# EAGLE design PB32_3.x (EAGLE 9.6.2)
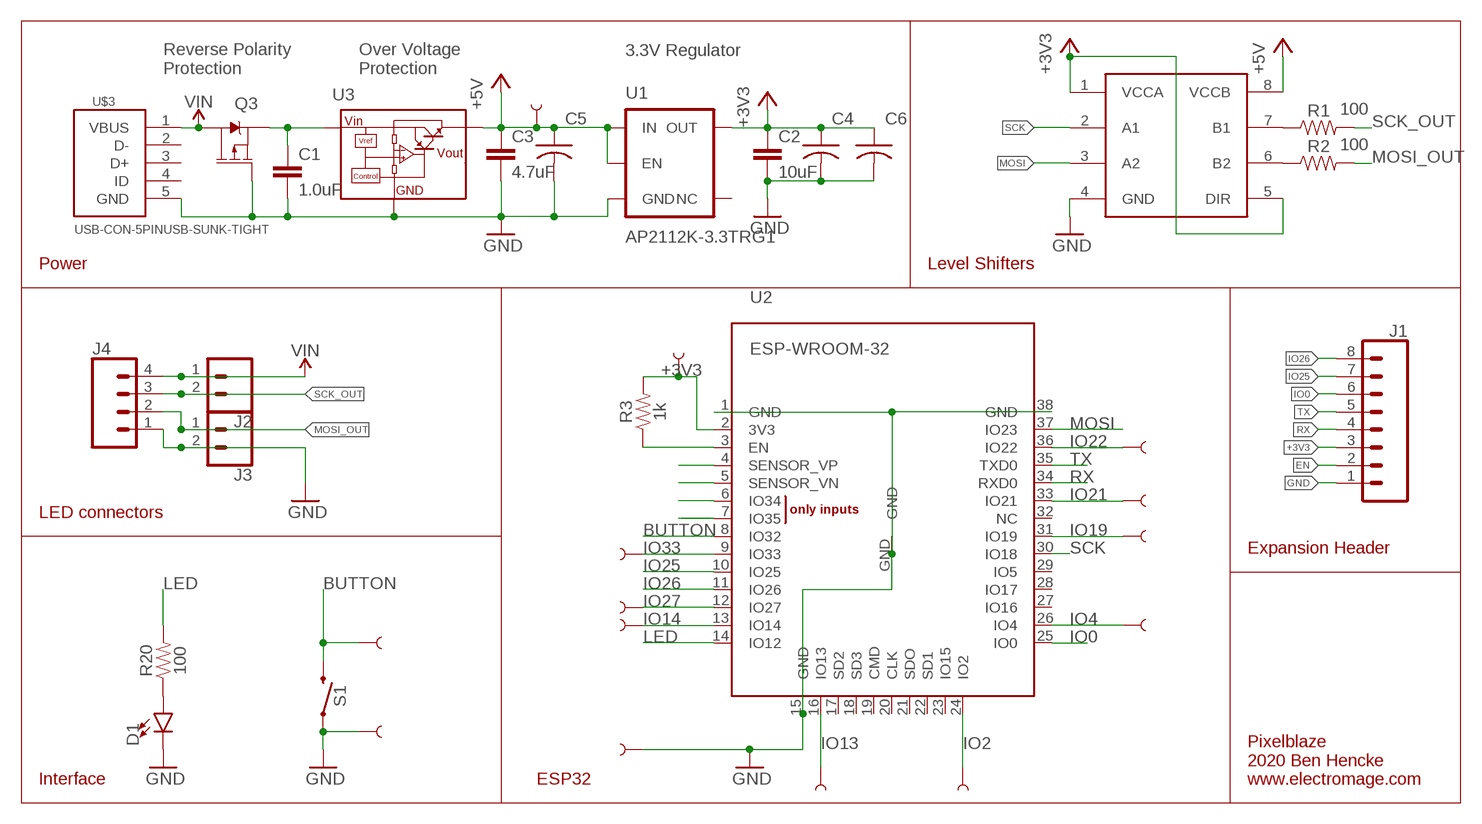
[diagram p0: schematic, sheet 1]

## Parts
C1  1.0uF  1.0UF-25V-+80/-20(0805)"  [0805-CAP]
C2  10uF  10UF-0805-10V-10%  [0805]
C3  4.7uF  4.7UF0603  [0603]
C4  0.1uF  C-USC0402K  [C0402K]
C5  0.1uF  C-USC0402K  [C0402K]
C6  0.1uF  C-USC0402K  [C0402K]
D1  LED0603  [LED-0603]
GP1  SMTPAD  [PAD]
GP3  SMTPAD  [PAD]
GP6  SMTPAD  [PAD]
GP8  SMTPAD  [PAD]
GP9  SMTPAD  [PAD]
IO2  SMTPAD  [PAD]
IO4  SMTPAD  [PAD]
IO13  SMTPAD  [PAD]
IO14  SMTPAD  [PAD]
IO19  SMTPAD  [PAD]
IO21  SMTPAD  [PAD]
IO22  SMTPAD  [PAD]
IO27  SMTPAD  [PAD]
IO33  SMTPAD  [PAD]
J1  CONN_08LOCK  [1X08_LOCK]
J2  CONN_025MM  [SCREWTERMINAL-5MM-2]
J3  CONN_025MM  [SCREWTERMINAL-5MM-2]
J4  CONN_041X04_NO_SILK  [1X04_NO_SILK]
Q3  2.5A/30V/105mΩ  MOSFET_PCH-DMG2307L  [SOT23-3]
R1  100  100OHM-0603-1/10W-1%  [0603]
R2  100  100OHM-0603-1/10W-1%  [0603]
R3  1k  1KOHM-0603-1/10W-1%  [0603]
R20  100  100OHM-0603-1/10W-1%  [0603]
S1  MOMENTARY-SWITCH-SPST-SMD-5.2MM  [TACTILE_SWITCH_SMD_5.2MM]
U1  AP2112K-3.3TRG1  V_REG_AP2112K-3.3V  [SOT23-5]
U2  ESP-WROOM-32  [ESP-WROOM-32]
U3  NX1117C15Z  [SOT223]
U$1  SN74LVC2T45DCUR  [SOP50P310X90-8N]
U$3  USB-CON-5PINUSB-SUNK-TIGHT  [USB-SUNK-TIGHT]

## Nets
+3V3: C2.1 C4.1 C6.1 GP1.P$1 J1.3 R3.2 U1.5(OUT) U2.2(3V3) U$1.1(VCCA) U$1.5(DIR)
+5V: C3.1 C5.1 GP6.P$1 U1.1(IN) U1.3(EN) U3.2(VOUT) U3.4(VOUT) U$1.8(VCCB)
BUTTON: GP8.P$1 S1.3 U2.8(IO32)
EN: J1.2 R3.1 U2.3(EN)
GND: C1.2 C2.2 C3.2 C4.2 C5.2 C6.2 D1.C GP3.P$1 GP9.P$1 J1.1 J3.2 J4.1 Q3.1(G) S1.1 U1.2(GND) U2.1(GND) U2.15(GND) U2.38(GND) U2.GND U3.1(GND) U$1.4(GND) U$3.5(GND)
IO0: J1.6 U2.25(IO0)
IO2: IO2.P$1 U2.24(IO2)
IO4: IO4.P$1 U2.26(IO4)
IO13: IO13.P$1 U2.16(IO13)
IO14: IO14.P$1 U2.13(IO14)
IO19: IO19.P$1 U2.31(IO19)
IO21: IO21.P$1 U2.33(IO21)
IO22: IO22.P$1 U2.36(IO22)
IO25: J1.7 U2.10(IO25)
IO26: J1.8 U2.11(IO26)
IO27: IO27.P$1 U2.12(IO27)
IO33: IO33.P$1 U2.9(IO33)
LED: R20.2 U2.14(IO12)
MOSI: U2.37(IO23) U$1.3(A2)
MOSI_OUT: J3.1 J4.2 R2.2
N$1: U2.6(IO34)
N$2: C1.1 Q3.2(S) U3.3(VIN)
N$3: U2.7(IO35)
N$4: R1.1 U$1.7(B1)
N$5: R2.1 U$1.6(B2)
N$6: U2.5(SENSOR_VN)
N$7: U2.4(SENSOR_VP)
N$29: D1.A R20.1
RX: J1.4 U2.34(RXD0)
SCK: U2.30(IO18) U$1.2(A1)
SCK_OUT: J2.2 J4.3 R1.2
TX: J1.5 U2.35(TXD0)
VIN: J2.1 J4.4 Q3.3(D) U$3.1(VBUS)
Unconnected: U1.4(NC) U2.17(SD2) U2.18(SD3) U2.19(CMD) U2.20(CLK) U2.21(SDO) U2.22(SD1) U2.23(IO15) U2.27(IO16) U2.28(IO17) U2.29(IO5) U2.32(NC) U$3.2(D-) U$3.3(D+) U$3.4(ID)

## Notes on the sheet
- 3.3V Regulator
- Reverse Polarity
  Protection
- Over Voltage
  Protection
- Power | Level Shifters
- LED connectors
- Expansion Header
- Interface | ESP32
- Pixelblaze
  2020 Ben Hencke
  www.electromage.com

## Library data of the parts
C1 = SparkFun-Capacitors:1.0UF-25V-+80/-20(0805): CAP-11625; PROD_ID: CAP-11625
C2 = SparkFun-Capacitors:10UF: 10.0µF ceramic capacitors A capacitor is a passive two-terminal electrical component used to store electrical energy temporarily in an electric field.; PROD_ID: CAP-11330
C3 = SparkFun-Capacitors:4.7UF: 4.7µF ceramic capacitors A capacitor is a passive two-terminal electrical component used to store electrical energy temporarily in an electric field.; PROD_ID: CAP-08280
C4-C6 = adafruit:C-US: CAPACITOR, American symbol
D1 = SparkFun-LED:LED: LED (Generic) Standard schematic elements and footprints for 5mm, 3mm, 1206, and 0603 sized LEDs. Generic LEDs with no color specified.
GP1 GP3 GP6 GP8 GP9 IO2 IO4 IO13 IO14 IO19 IO21 IO22 IO27 IO33 = bens:SMTPAD
J1 = SparkFun-Connectors:CONN_08: Multi connection point. Often used as Generic Header-pin footprint for 0.1 inch spaced/style header connections On any of the 0.1 inch spaced packages, you can populate with these: Break Away Headers - Straight <https://www.sparkfun.com/products/116> (PRT-00116) Break Away Male Headers - Right Angle <https://www.sparkfun.com/products/553> (PRT-00553) Female Headers <https://www.sparkfun.com/products/115> (PRT-00115) Break Away Headers - Machine Pin <https://www.sparkfun.com/products/117> (PRT-00117) Break Away Female Headers - Swiss Machine Pin <https://www.sparkfun.com/products/743> (PRT-00743) Arduino Stackable Header - 8 Pin <https://www.sparkfun.com/products/9279> (PRT-09279) For SCREWTERMINALS and SPRING TERMINALS visit here: Screw Terimnals on SparkFun.com <https://www.sparkfun.com/search/results?term=Screw+Terminals> (5mm/3.5mm/2.54mm spacing) This device is also useful as a general connection point to wire up your design to another part of your project. Our various solder wires solder well into these plated through hole pads. Hook-Up Wire - Assortment (Stranded, 22 AWG) <https://www.sparkfun.com/products/11375> (PRT-11375) Hook-Up Wire - Assortment (Solid Core, 22 AWG) <https://www.sparkfun.com/products/11367> (PRT-11367) View the entire wire category on our website here <https://www.sparkfun.com/categories/141> Special notes: Molex polarized connector foot print use with SKU : PRT-08231 with associated crimp pins and housings. 1MM SMD Version SKU: PRT-10208 NOTES ON THE VARIANTS LOCK and LOCK_LONGPADS... This footprint was designed to help hold the alignment of a through-hole component (i.e. 6-pin header) while soldering it into place. You may notice that each hole has been shifted either up or down by 0.005 of an inch from it's more standard position (which is a perfectly straight line). This slight alteration caused the pins (the squares in the middle) to touch the edges of the holes. Because they are alternating, it causes a "brace" to hold the component in place. 0.005 has proven to be the perfect amount of "off-center" position when using our standard breakaway headers. Although looks a little odd when you look at the bare footprint, once you have a header in there, the alteration is very hard to notice. Also,if you push a header all the way into place, it is covered up entirely on the bottom side.
J2 J3 = bens:CONN_02: Multi connection point. Often used as Generic Header-pin footprint for 0.1 inch spaced/style header connections On any of the 0.1 inch spaced packages, you can populate with these: Break Away Headers - Straight <https://www.sparkfun.com/products/116> (PRT-00116) Break Away Male Headers - Right Angle <https://www.sparkfun.com/products/553> (PRT-00553) Female Headers <https://www.sparkfun.com/products/115> (PRT-00115) Break Away Headers - Machine Pin <https://www.sparkfun.com/products/117> (PRT-00117) Break Away Female Headers - Swiss Machine Pin <https://www.sparkfun.com/products/743> (PRT-00743) For SCREWTERMINALS and SPRING TERMINALS visit here: Screw Terimnals on SparkFun.com <https://www.sparkfun.com/search/results?term=Screw+Terminals> (5mm/3.5mm/2.54mm spacing) This device is also useful as a general connection point to wire up your design to another part of your project. Our various solder wires solder well into these plated through hole pads. Hook-Up Wire - Assortment (Stranded, 22 AWG) <https://www.sparkfun.com/products/11375> (PRT-11375) Hook-Up Wire - Assortment (Solid Core, 22 AWG) <https://www.sparkfun.com/products/11367> (PRT-11367) View the entire wire category on our website here <https://www.sparkfun.com/categories/141> Special notes: Molex polarized connector foot print use with: PRT-08233 with associated crimp pins and housings. 2.54_SCREWTERM for use with PRT-10571. 3.5mm Screw Terminal footprints for PRT-08084 5mm Screw Terminal footprints for use with PRT-08432; SF_SKU: PRT-08432
J4 = SparkFun-Connectors:CONN_04: Multi connection point. Often used as Generic Header-pin footprint for 0.1 inch spaced/style header connections On any of the 0.1 inch spaced packages, you can populate with these: Break Away Headers - Straight <https://www.sparkfun.com/products/116> (PRT-00116) Break Away Male Headers - Right Angle <https://www.sparkfun.com/products/553> (PRT-00553) Female Headers <https://www.sparkfun.com/products/115> (PRT-00115) Break Away Headers - Machine Pin <https://www.sparkfun.com/products/117> (PRT-00117) Break Away Female Headers - Swiss Machine Pin <https://www.sparkfun.com/products/743> (PRT-00743) For SCREWTERMINALS and SPRING TERMINALS visit here: Screw Terimnals on SparkFun.com <https://www.sparkfun.com/search/results?term=Screw+Terminals> (5mm/3.5mm/2.54mm spacing) This device is also useful as a general connection point to wire up your design to another part of your project. Our various solder wires solder well into these plated through hole pads. Hook-Up Wire - Assortment (Stranded, 22 AWG) <https://www.sparkfun.com/products/11375> (PRT-11375) Hook-Up Wire - Assortment (Solid Core, 22 AWG) <https://www.sparkfun.com/products/11367> (PRT-11367) View the entire wire category on our website here <https://www.sparkfun.com/categories/141> Special notes: Molex polarized connector foot print use with SKU : PRT-08231 with associated crimp pins and housings. 1MM SMD Version SKU: PRT-10208; PROD_ID: CONN-09696
Q3 = SparkFun-DiscreteSemi:MOSFET_PCH: P-channel MOSFETs Voltage controlled devices that allow control of high current outputs. SparkFun Products: SparkFun ESP32 Thing <https://www.sparkfun.com/products/13907> SparkFun ESP8266 Thing <https://www.sparkfun.com/products/13231>; PROD_ID: TRANS-11308
R1 R2 R20 = SparkFun-Resistors:100OHM: 100Ω resistor A resistor is a passive two-terminal electrical component that implements electrical resistance as a circuit element. Resistors act to reduce current flow, and, at the same time, act to lower voltage levels within circuits. - Wikipedia; PROD_ID: RES-07863
R3 = SparkFun-Resistors:1KOHM: 1kΩ resistor A resistor is a passive two-terminal electrical component that implements electrical resistance as a circuit element. Resistors act to reduce current flow, and, at the same time, act to lower voltage levels within circuits. - Wikipedia; PROD_ID: RES-07856
S1 = SparkFun-Switches:MOMENTARY-SWITCH-SPST: Momentary Switch (Pushbutton) - SPST Normally-open (NO) SPST momentary switches (buttons, pushbuttons). Variants PTH-12MM - 12mm square, through-hole Momentary Pushbutton Switch - 12mm Square <https://www.sparkfun.com/products/9190> (COM-09190) PTH-6.0MM, PTH-6.0MM-KIT - 6.0mm square, through-hole Mini Pushbutton Switch <https://www.sparkfun.com/products/97> (COM-00097) KIT package intended for soldering kit's - only one side of pads' copper is exposed. PTH-RIGHT-ANGLE-KIT - Right-angle, through-hole Right Angle Tactile Button <https://www.sparkfun.com/products/10791> - Used on SparkFun BigTime Watch Kit <https://www.sparkfun.com/products/11734> SMD-12MM - 12mm square, surface-mount Tactile Button - SMD (12mm) <https://www.sparkfun.com/products/12993> (COM-12993) Used on SparkFun PicoBoard <https://www.sparkfun.com/products/11888> SMD-4.5MM - 4.5mm Square Trackball Switch Used on SparkFun Blackberry Trackballer Breakout <https://www.sparkfun.com/products/13169> SMD-4.6MMX2.8MM - 4.60mm x 2.80mm, surface mount Used on SparkFun SAMD21 Mini Breakout <https://www.sparkfun.com/products/13664> SMD-5.2MM, SMD-5.2-REDUNDANT - 5.2mm square, surface-mount Mini Pushbutton Switch - SMD <https://www.sparkfun.com/products/8720> (COM-08720) Used on Arduino Pro Mini <https://www.sparkfun.com/products/11114> REDUNDANT package connects both switch circuits together SMD-6.0X3.5MM - 6.0 x 3.5mm, surface mount Momentary Reset Switch SMD <https://www.sparkfun.com/products/8229> (COM-08229) SMD-6.2MM-TALL - 6.2mm square, surface mount Tactile Button - SMD (6mm) <https://www.sparkfun.com/products/12992> Used on SparkFun Digital Sandbox <https://www.sparkfun.com/products/12651> SMD-RIGHT-ANGLE - Right-angle, surface mount Used on SparkFun Block for Intel® Edison - Arduino <https://www.sparkfun.com/products/13036>; PROD_ID: SWCH-08247; SF_SKU: COM-08720
U1 = SparkFun-PowerIC:V_REG_AP2112: AP2112 - 600mA CMOS LDO Regulator w/ Enable The AP2112 is CMOS process low dropout linear regulator with enable function, the regulator delivers a guaranteed 600mA (min.) continuous load current. Features Output Voltage Accuracy: ±1.5% Output Current: 600mA (Min.) Foldback Short Current Protection: 50mA Enable Function to Turn ON/OFF VOUT Low Dropout Voltage (3.3V): 250mV (Typ.) @IOUT=600mA Excellent Load Regulation: 0.2%/A (Typ.) Excellent Line Regulation: 0.02%/V (Typ.) Low Quiescent Current: 55μA (Typ.) Low Standby Current: 0.01μA (Typ.) Low Output Noise: 50μVRMS PSRR: 100Hz -65dB, 1kHz -65dB OTSD Protection Stable with 1.0μF Flexible Cap: Ceramic, Tantalum and Aluminum Electrolytic Operation Temperature Range: -40°C to 85°C ESD: MM 400V, HBM 4000V; PROD_ID: VREG-12457; VALUE: 3.3V
U2 = esp32:ESP-WROOM-32
U3 = NXP_60_26022015:NX1117C: The NX1117C/NX1117CE are two series of low-dropout positive voltage regulators with an output current capability of 1 A. AAL Eindhoven MK; 12NC: 9352 914 35115; TOLERANCE: 1.25%; VOLTAGE: 5.0V
U$1 = SOP50P310X90-8N:SN74LVC2T45DCUR
U$3 = bens:USB-CON-5PIN: Molex Micro USB 105017-0001

## Net classes
1 power: width 0.635 mm

## Board
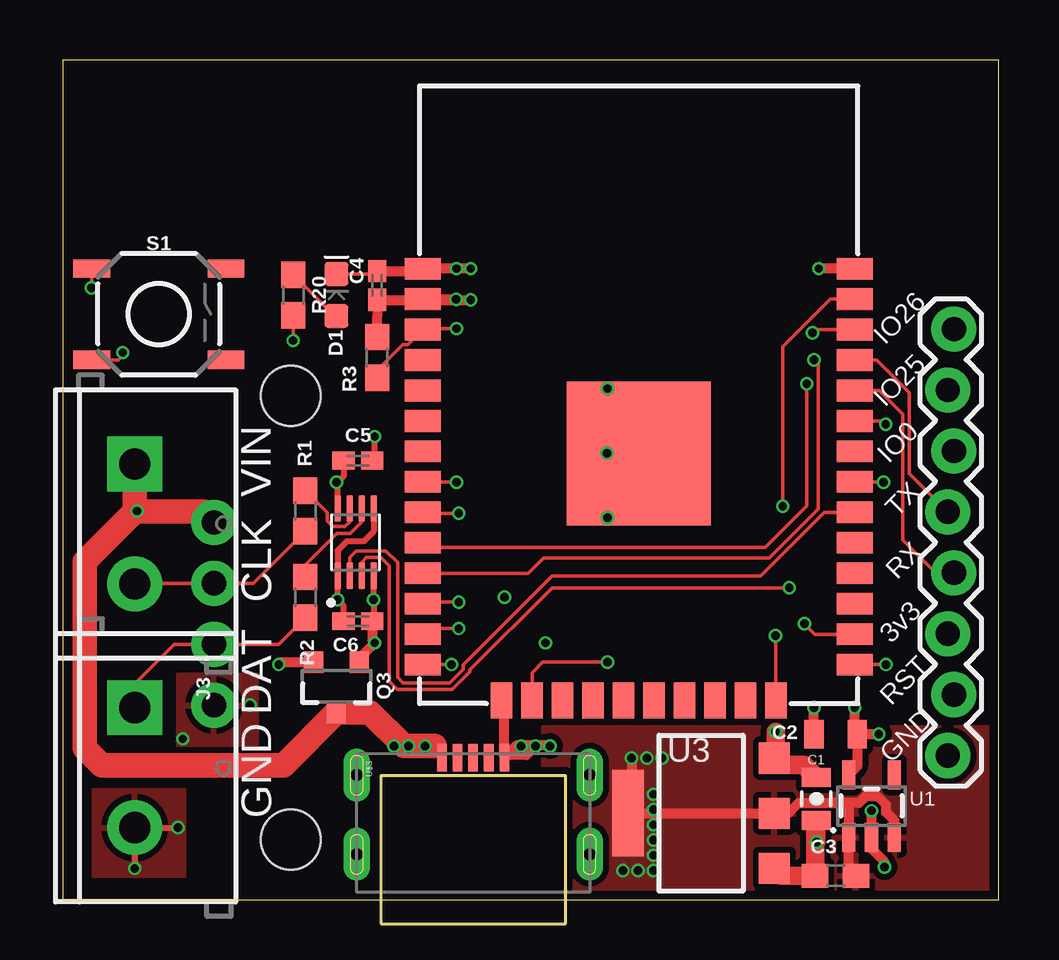
[diagram p1: board, top side]
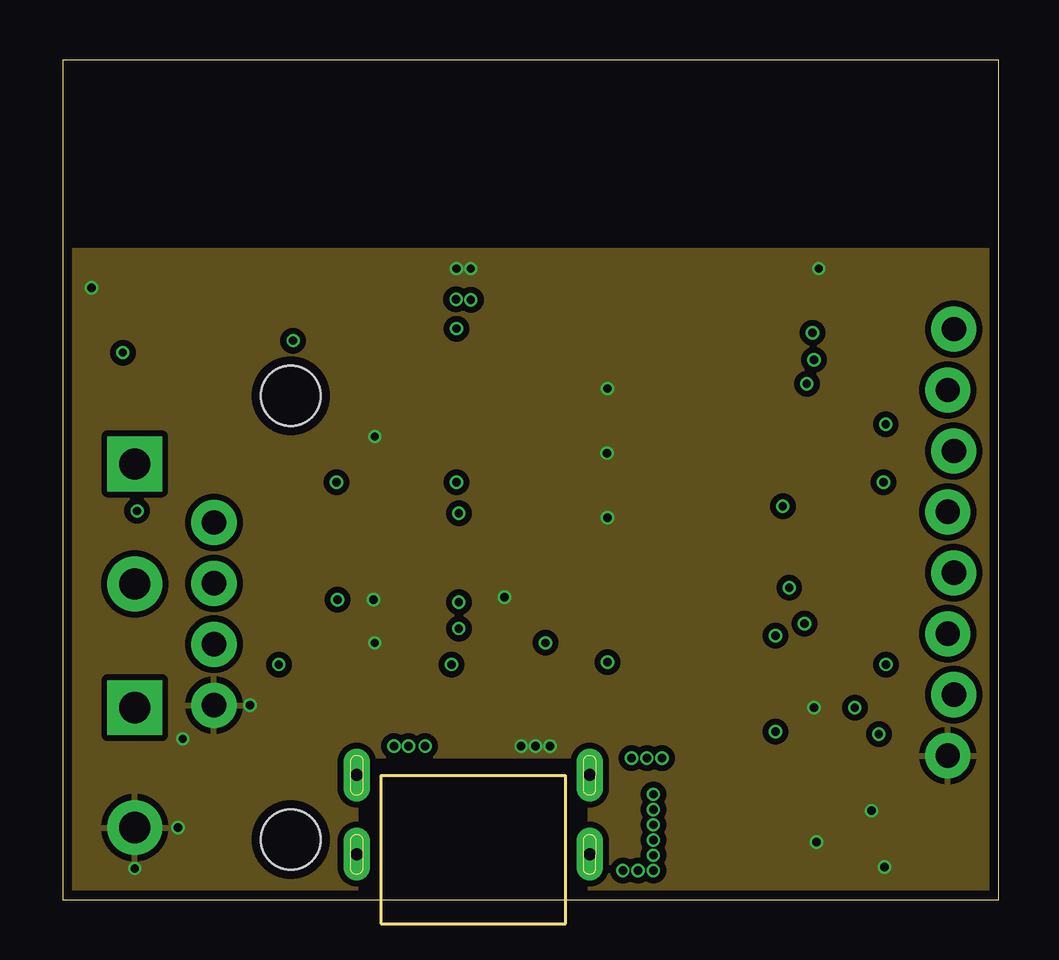
[diagram p2: board, inner layer Route2]
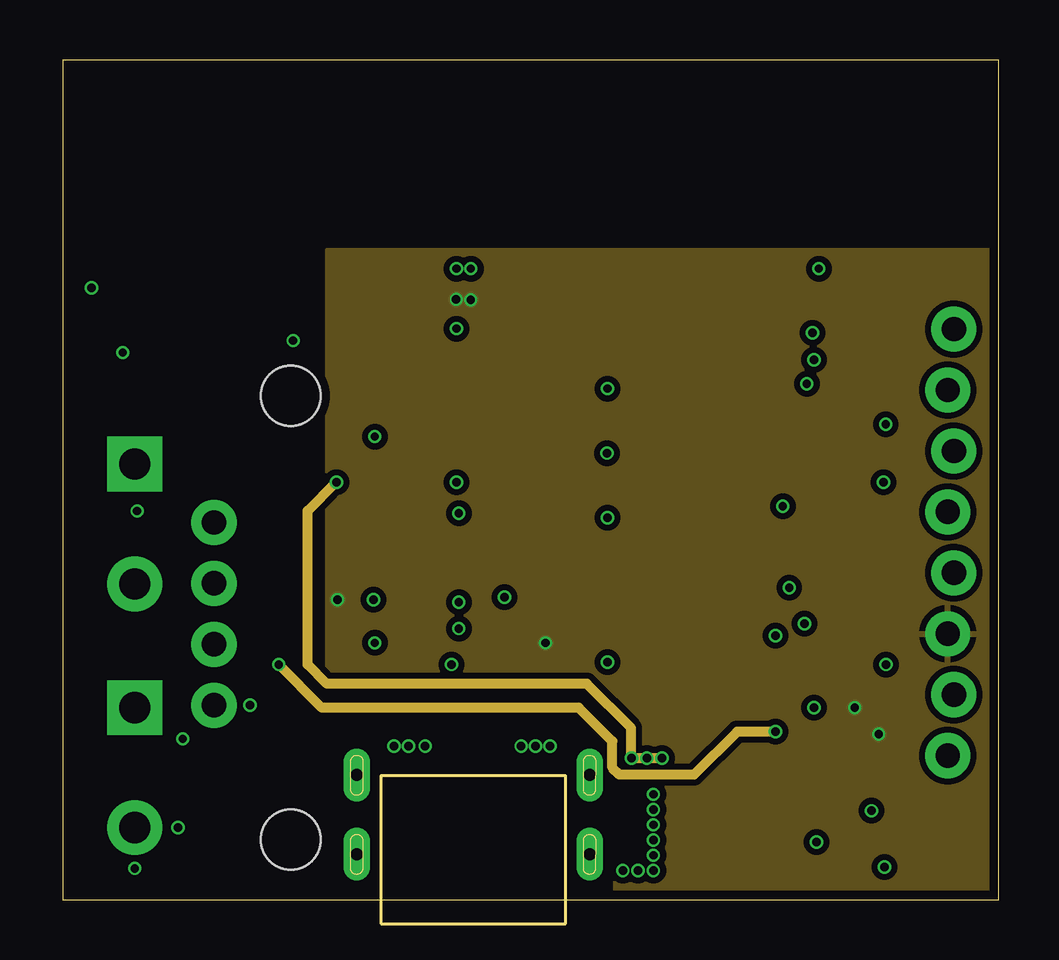
[diagram p3: board, inner layer Route15]
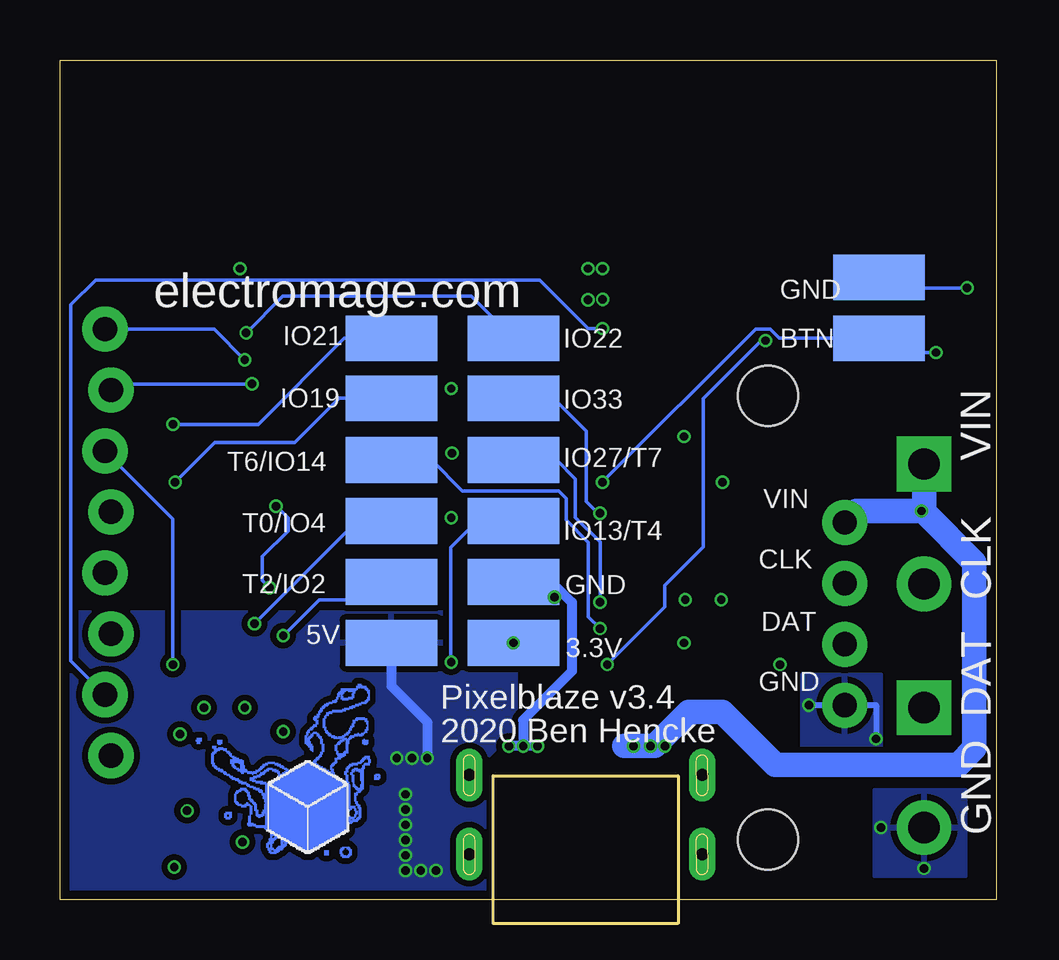
[diagram p4: board, bottom side, seen from below]

Size 39 x 35 mm. Coordinates in mm from the lower left corner, seen from the top.
Outline: 0,0 39,0 39,35 0,35 0,0
Copper layers (1*2*15*16): Top 0.035559375mm / dielectric 0.17018125mm / Route2 0.01778125mm / dielectric 47mil / Route15 0.01778125mm / dielectric 0.17018125mm / Bottom 0.035559375mm
Design rules "oshpark-4layer *": minimum track width 5mil, minimum drill 10mil, track to track 5mil, track to pad 5mil, pad to pad 5mil, via to via 5mil, smd to smd 5mil, copper to edge 15mil, drill to drill 6mil, minimum pad ring 4mil, minimum via ring 4mil, stop-mask expansion 1mil, vias tented up to drill 15mil, thermal gap 10mil
Holes 2.5 mm at 9.5,21 9.5,2.5
tRestrict: area 13.2,0.1 to 20.9,5.2

### Footprints (pad centres in the part's own frame; a part is rotated, then mirrored left to right if it is on the bottom)
0805-CAP = smd 0.8 x 1.2: 1 -0.9,0; 2 0.9,0
0805 = smd 0.8 x 1.2: 1 -0.9,0; 2 0.9,0
0603 = smd 1.1 x 1: 1 -0.85,0; 2 0.85,0
C0402K = smd 0.925 x 0.74: 1 -0.6,0; 2 0.6,0
LED-0603 = smd 1 x 1: A -0.877,0; C 0.877,0
PAD = smd 3.81 x 1.905: P$1 0,0
1X08_LOCK = drill 1.016 pad 1.88: 1 0,0.127; 2 2.54,-0.127; 3 5.08,0.127; 4 7.62,-0.127; 5 10.16,0.127; 6 12.7,-0.127; 7 15.24,0.127; 8 17.78,-0.127
SCREWTERMINAL-5MM-2 = drill 1.3 pad 2.286 square: 1 0,0 | drill 1.3 pad 2.286: 2 5,0
1X04_NO_SILK = drill 1.016 pad 1.88: 1 0,0; 2 2.54,0; 3 5.08,0; 4 7.62,0
SOT23-3 = smd 0.8 x 0.9: 1 -0.95,-1; 2 0.95,-1; 3 0,1.1
TACTILE_SWITCH_SMD_5.2MM = smd 1.524 x 0.762: 1 -2.794,1.905; 2 2.794,1.905; 3 -2.794,-1.905; 4 2.794,-1.905
SOT23-5 = smd 0.55 x 1.2: 1 -0.95,-1.3; 2 0,-1.3; 3 0.95,-1.3; 4 0.95,1.3; 5 -0.95,1.3
ESP-WROOM-32 = smd 0.9 x 1.5: 1 7.7,9; 2 6.43,9; 3 5.16,9; 4 3.89,9; 5 2.62,9; 6 1.35,9; 7 0.08,9; 8 -1.19,9; 9 -2.46,9; 10 -3.73,9; 11 -5,9; 12 -6.27,9; 13 -7.54,9; 14 -8.81,9; 25 -8.81,-9; 26 -7.54,-9; 27 -6.27,-9; 28 -5,-9; 29 -3.73,-9; 30 -2.46,-9; 31 -1.19,-9; 32 0.08,-9; 33 1.35,-9; 34 2.62,-9; 35 3.89,-9; 36 5.16,-9; 37 6.43,-9; 38 7.7,-9 | smd 1.5 x 0.9: 15 -10.3,5.715; 16 -10.3,4.445; 17 -10.3,3.175; 18 -10.3,1.905; 19 -10.3,0.635; 20 -10.3,-0.635; 21 -10.3,-1.905; 22 -10.3,-3.175; 23 -10.3,-4.445; 24 -10.3,-5.715 | smd 6 x 6: GND 0,0
SOT223 = smd 1.3 x 1.3: 1 -2.3,-3.05; 2 0,-3.05; 3 2.3,-3.05 | smd 3.6 x 1.3: 4 0,3.05
SOP50P310X90-8N = smd 1.12 x 0.27: 1 -1.405,0.75; 2 -1.405,0.25; 3 -1.405,-0.25; 4 -1.405,-0.75; 5 1.405,-0.75; 6 1.405,-0.25; 7 1.405,0.25; 8 1.405,0.75
USB-SUNK-TIGHT = smd 0.4 x 1.15: 1 -1.3,2.625; 2 -0.65,2.625; 3 0,2.625; 4 0.65,2.625; 5 1.3,2.625 | drill 0.5 pad 1.1 long: 6 -4.85,1.89; 7 -4.85,-1.41; 8 4.85,1.89; 9 4.85,-1.41 | smd 0.1 x 0.1: P$4 -4.826,-2.413; P$5 4.826,-2.413

### Placement (x,y rotation side)
C1  31.4,4.2 270 top
C2  32.2,6.9 180 top
C3  32.2,1 180 top
C4  13.1,25.6 90 top
C5  12.3,18.3 0 top
C6  12.3,11.6 0 top
D1  11.4,25.2 90 top
GP1  20.11,10.7 0 bottom
GP3  20.11,13.24 0 bottom
GP6  25.19,10.7 0 bottom
GP8  4.87,23.4 0 bottom
GP9  4.87,25.94 0 bottom
IO2  25.19,13.24 0 bottom
IO4  25.19,15.78 0 bottom
IO13  20.11,15.78 0 bottom
IO14  25.19,18.32 0 bottom
IO19  25.19,20.9 0 bottom
IO21  25.19,23.4 0 bottom
IO22  20.11,23.4 0 bottom
IO27  20.11,18.32 0 bottom
IO33  20.11,20.9 0 bottom
J1  37,6 90 top
J2  3,18.16 270 top
J3  3,8 270 top
J4  6.3,8.1 90 top
Q3  11.4,8.9 180 top
R1  10.1,16.2 270 top
R2  10.1,12.6 270 top
R3  13.1,22.6 90 top
R20  9.6,25.2 270 top
S1  4,24.4 0 top
U1  33.7,3.9 0 top
U2  24,18.6 90 top
U3  26.6,3.6 90 top
U$1  12.2,14.9 90 top
U$2  [ELECTRO_MAGE_PCB4_PIXEL_2#PNG]  29.5,5.4 0 bottom
U$3  17.1,3.3 0 top

### Tracks (layer width: path | path; a pad name or v marks a point on that pad's centre or on a via)
+3V3  (via drill 0.35)
  Top 0.254: U$1.5 12.95,15.35 12.53,14.93 11.83,14.93 11.45,14.55 U$1.1 v11.45,12.5 11.7,12.25 C6.1
  Top 0.406: v16.39,25.02 v16.38,25.03 U2.2 | R3.2 13.1,24.3 C4.1 14.97,25 U2.2 | C2.1 33.1,5.55 U1.5 | C2.1 v34,6.9 | C2.1 33,7 v33,8 | U2.2 15.03,25 v17,25
  other vias: 20.11,10.7
  pour Route15 (isolate 0.254, rank 6): 11,27.1 39,27.1 39,0 23,0 23,8.3 11,8.3
+5V  (via drill 0.35)
  Top 0.254: U$1.8 11.45,17.35 | 11.45,17.35 11.45,17.4 11.7,17.65 C5.1 | 11.45,17.35 v11.4,17.4
  Top 0.406: v23.7,5.9 23.7,3.75 U3.4 U3.2 30.23,3.6 30.66,4.03 32,4.03 | U1.3 34.65,3.29 34.31,3.63 34.31,3.95 33.95,4.31 33.45,4.31 33.17,4.03 32,4.03 | 32,4.03 32.75,4.03 U1.1 32.75,1.3 C3.1 | C3.1
  Route15 0.406: v11.4,17.4 10.2,16.2 10.2,9.8 11,9 21.84,9 23.68,7.16 23.68,5.92 v23.7,5.9 v24.97,5.9
  Bottom 0.406: GP6.P$1 25.19,8.9 23.7,7.41 v23.7,5.9
  other vias: 24.34,5.9 24.61,4.38 24.61,3.75 24.61,3.12 24.61,2.48 24.61,1.84 24.61,1.21 23.97,1.21 23.34,1.21
  pour Top (isolate 0.254, rank 6): 20,0 39,0 39,7.2 20,7.2
  pour Bottom (isolate 0.254, rank 6): 39,0 21.3,0 21.3,5.8 20,7.1 20,12 39,12
BUTTON  (via drill 0.35)
  Top 0.152: U2.8 v16.39,17.41 v16.4,17.4 | v2.5,22.8 2.47,22.77 2.47,22.66 2.31,22.5 S1.3
  Bottom 0.152: v2.5,22.8 4.27,22.8 GP8.P$1 9.02,23.4 9.4,23.78 10.02,23.78 v16.4,17.4
EN  (via drill 0.35)
  Top 0.152: R3.1 13.1,22.08 14.17,23.14 14.38,23.14 U2.3 15.04,23.8 v16.4,23.8
  Bottom 0.152: J1.2 38.54,9.96 38.54,24.79 37.52,25.82 19.02,25.82 17,23.8 v16.4,23.8
GND  (via drill 0.35)
  Top 0.152: D1.C 13,26.08 C4.2 | S1.1 v1.2,25.5
  Top 0.254: C6.2 12.9,11.7 12.95,11.75 v12.95,12.5 U$1.4 | v13,19.3 13,18.4 C5.2 | v4.8,3 J3.2 v3,1.3
  Top 0.406: v17,26.3 v16.4,26.3 U2.1 14.9,26.2 C4.2 | v33.7,3.7 U1.2 33.7,2.11 34.24,1.57 v34.24,1.36 | C2.2 v31.3,8 | U$3.5 18.88,6.4 v19.1,6.4 | U$3.5 18.5,6.03 19.32,6.03 v19.7,6.4 | Q3.1 12.35,10.05 v13,10.7 12.9,10.8 C6.2 | v20.3,6.4 20.27,6.42 18.9,6.42 U$3.5 | U$3.5 18.4,8.19 U2.15 | U2.38 v31.5,26.3 | U2.GND arc45 23.98,18.61 v22.67,18.61
  Top 0.762: U3.1 29.95,1 C3.2 31.35,3.25 C1.2 v31.4,2.4
  Bottom 0.152: GP9.P$1 4.43,25.5 v1.2,25.5 | GP3.P$1 19.04,13.24 v18.4,12.6
  Bottom 0.254: v7.8,8.1 5,8.1 v5,6.7
  Bottom 0.406: v19.7,6.4 19.7,7.49 17.68,9.51 17.68,12.39 18.53,13.24 GP3.P$1 | v19.1,6.4 v20.3,6.4
  other vias: 22.7,21.3 22.7,15.92
  pour Route2 (isolate 0.254, rank 6): 0,27.1 39,27.1 39,0 21.94,0 21.94,5.94 12.25,5.94 12.25,0 0,0
  pour Top (rank 6): 5.08,4.57 1.27,4.57 1.27,0.97 5.08,0.97
  pour Bottom (rank 6): 5.08,4.57 1.27,4.57 1.27,0.97 5.08,0.97
  pour Top (isolate 0.254, rank 6): 8.1,9.39 4.78,9.39 4.78,6.35 8.1,6.35
  pour Bottom (isolate 0.254, rank 6): 8.1,9.39 4.78,9.39 4.78,6.35 8.1,6.35
IO0  (via drill 0.35)
  Top 0.152: v34.3,9.8 U2.25
  Bottom 0.152: J1.6 34.3,15.87 v34.3,9.8
IO2  (via drill 0.35)
  Top 0.152: U2.24 29.71,10.98 v29.7,11
  Bottom 0.152: IO2.P$1 25.93,12.5 28.2,12.5 v29.7,11
IO4  (via drill 0.35)
  Top 0.152: U2.26 31.34,11.06 v30.9,11.5
  Bottom 0.152: v30.9,11.5 26.62,15.78 IO4.P$1
IO13  (via drill 0.35)
  Top 0.152: v22.7,9.9 20,9.9 19.55,9.46 U2.16
  Bottom 0.152: IO13.P$1 21.61,15.78 22.72,14.68 22.72,9.92 v22.7,9.9
IO14  (via drill 0.35)
  Top 0.152: v16.5,11.3 15.24,11.3 U2.13
  Bottom 0.152: IO14.P$1 23.52,18.32 22.24,17.04 18.22,17.04 17.9,16.72 17.9,15.82 16.98,14.89 16.98,11.78 v16.5,11.3
IO19  (via drill 0.35)
  Top 0.152: U2.31 v34.19,17.41 v34.2,17.4
  Bottom 0.152: v34.2,17.4 32.55,19.05 29.21,19.05 27.36,20.9 IO19.P$1
IO21  (via drill 0.35)
  Top 0.152: U2.33 34.15,19.95 v34.29,19.81
  Bottom 0.152: IO21.P$1 27.15,23.4 30.73,19.81 v34.29,19.81
IO22  (via drill 0.35)
  Top 0.152: U2.36 31.38,23.76 v31.24,23.62
  Bottom 0.152: IO22.P$1 21.86,25.15 29.72,25.15 v31.24,23.62
IO25  (via drill 0.35)
  Top 0.152: U2.10 15.2,14.67 29.27,14.67 31,16.4 v31,21.5
  Bottom 0.152: v31,21.5 36.61,21.5 J1.7
IO26  (via drill 0.35)
  Top 0.152: U2.11 19.4,13.6 20.04,14.24 29.44,14.24 31.48,16.29 31.48,22.32 v31.3,22.5
  Bottom 0.152: v31.3,22.5 32.58,23.78 J1.8
IO27  (via drill 0.35)
  Top 0.152: v16.5,12.4 15.07,12.4 U2.12
  Bottom 0.152: v16.5,12.4 16.5,14.91 17.52,15.93 17.52,17.53 18.31,18.32 IO27.P$1
IO33  (via drill 0.35)
  Top 0.152: v16.5,16.1 15.04,16.1 U2.9
  Bottom 0.152: IO33.P$1 18.45,20.9 17.08,19.54 17.08,16.6 16.58,16.1 v16.5,16.1
LED  (via drill 0.35)
  Top 0.152: U2.14 v16.2,9.8 | v9.6,23.3 R20.2
  Bottom 0.152: v16.2,9.8 13.8,12.2 13.8,13.1 12.2,14.7 12.2,20.89 9.79,23.3 v9.6,23.3
MOSI  (via drill 0.35)
  Top 0.152: U$1.3 12.45,14.06 12.65,14.26 13.25,14.26 13.6,13.91 13.6,9.1 13.94,8.76 16.23,8.76 16.96,9.49 16.96,9.57 20.39,13 v30.27,13 | v30,16.4 30,23.06 31.97,25.03 U2.37
  Bottom 0.152: v30,16.4 29.5,15.9 29.5,15.37 30.57,14.3 30.57,13.3 v30.27,13
MOSI_OUT
  Top 0.152: R2.2 8.99,10.64 J4.2 4.64,10.64 3,9 J3.1
N$2  (via drill 0.35)
  Top 0.406: v9,9.8 9.1,9.9 Q3.2
  Top 0.762: C1.1 30.88,5.62 30.12,5.62 29.85,5.9 U3.3 29.7,5.95 v29.7,7
  Route15 0.406: v29.7,7 28.1,7 26.3,5.2 23.2,5.2 22.9,5.5 22.9,6.6 21.5,8 10.8,8 v9,9.8
N$4
  Top 0.152: R1.1 11.01,16.14 11.01,15.78 11.25,15.54 11.75,15.54 11.95,15.74 U$1.7
N$5
  Top 0.152: R2.1 10.1,13.96 11.41,15.26 11.97,15.26 12.45,15.74 U$1.6
N$29
  Top 0.152: R20.1 11.33,24.32 D1.A
RX
  Top 0.152: U2.34 34.02,21.22 35,20.24 35,15 36.38,13.62 J1.4
SCK
  Top 0.152: U$1.2 11.95,14.26 12.23,14.54 13.46,14.54 13.95,14.06 13.95,9.26 14.17,9.04 16.11,9.04 16.68,9.6 16.68,9.78 20.39,13.49 29.09,13.49 31.73,16.14 U2.30
SCK_OUT
  Top 0.152: R1.2 7.93,13.18 J4.3 3.02,13.18 J2.2
TX
  Top 0.152: J1.5 35.28,17.75 35.28,21.13 33.92,22.49 U2.35
VIN  (via drill 0.35)
  Top 0.406: 15.5,6.4 15.8,6.1 U$3.1
  Top 1.016: J2.1 3,16.17 | 3,16.17 0.92,14.1 0.92,6.29 1.62,5.6 9.2,5.6 Q3.3 12.8,7.8 14.2,6.4 15.5,6.4 | 3,16.17 5.85,16.17 J4.4
  Bottom 0.152: v3.1,16.2 3.06,16.16 3,16.16
  Bottom 0.406: 15.5,6.4 v15.1,6.4 v14.4,6.4 v13.8,6.4
  Bottom 1.016: 15.5,6.4 14.23,6.4 12.8,7.83 11.4,7.83 9.19,5.62 1.58,5.62 0.9,6.3 0.9,14.06 3,16.16 J2.1 3,16.4 3.2,16.2 5.82,16.2 J4.4

### Text on the board
tPlace: IO26 | IO25 | IO0 | VIN | TX | RX | CLK | 3v3 | DAT | RST | GND | GND
bPlace: GND | electromage.com | BTN | IO22 | IO21 | IO19 | IO33 | VIN | IO27/T7 | T6/IO14 | VIN | IO13/T4 | T0/IO4 | CLK | GND | T2/IO2 | CLK | DAT | 5V | 3.3V | GND | DAT | Pixelblaze v3.4 | 2020 Ben Hencke | GND